# EasyEDA schematic PC Pump Controller_2021-02-13_17-24-19.json
TITLE: PC Fan to Pump Booster; REV: 2.0; Date: 2021-02-13; Sheet: 1/1; Drawn By: marshy459; Company: Dave Marsh
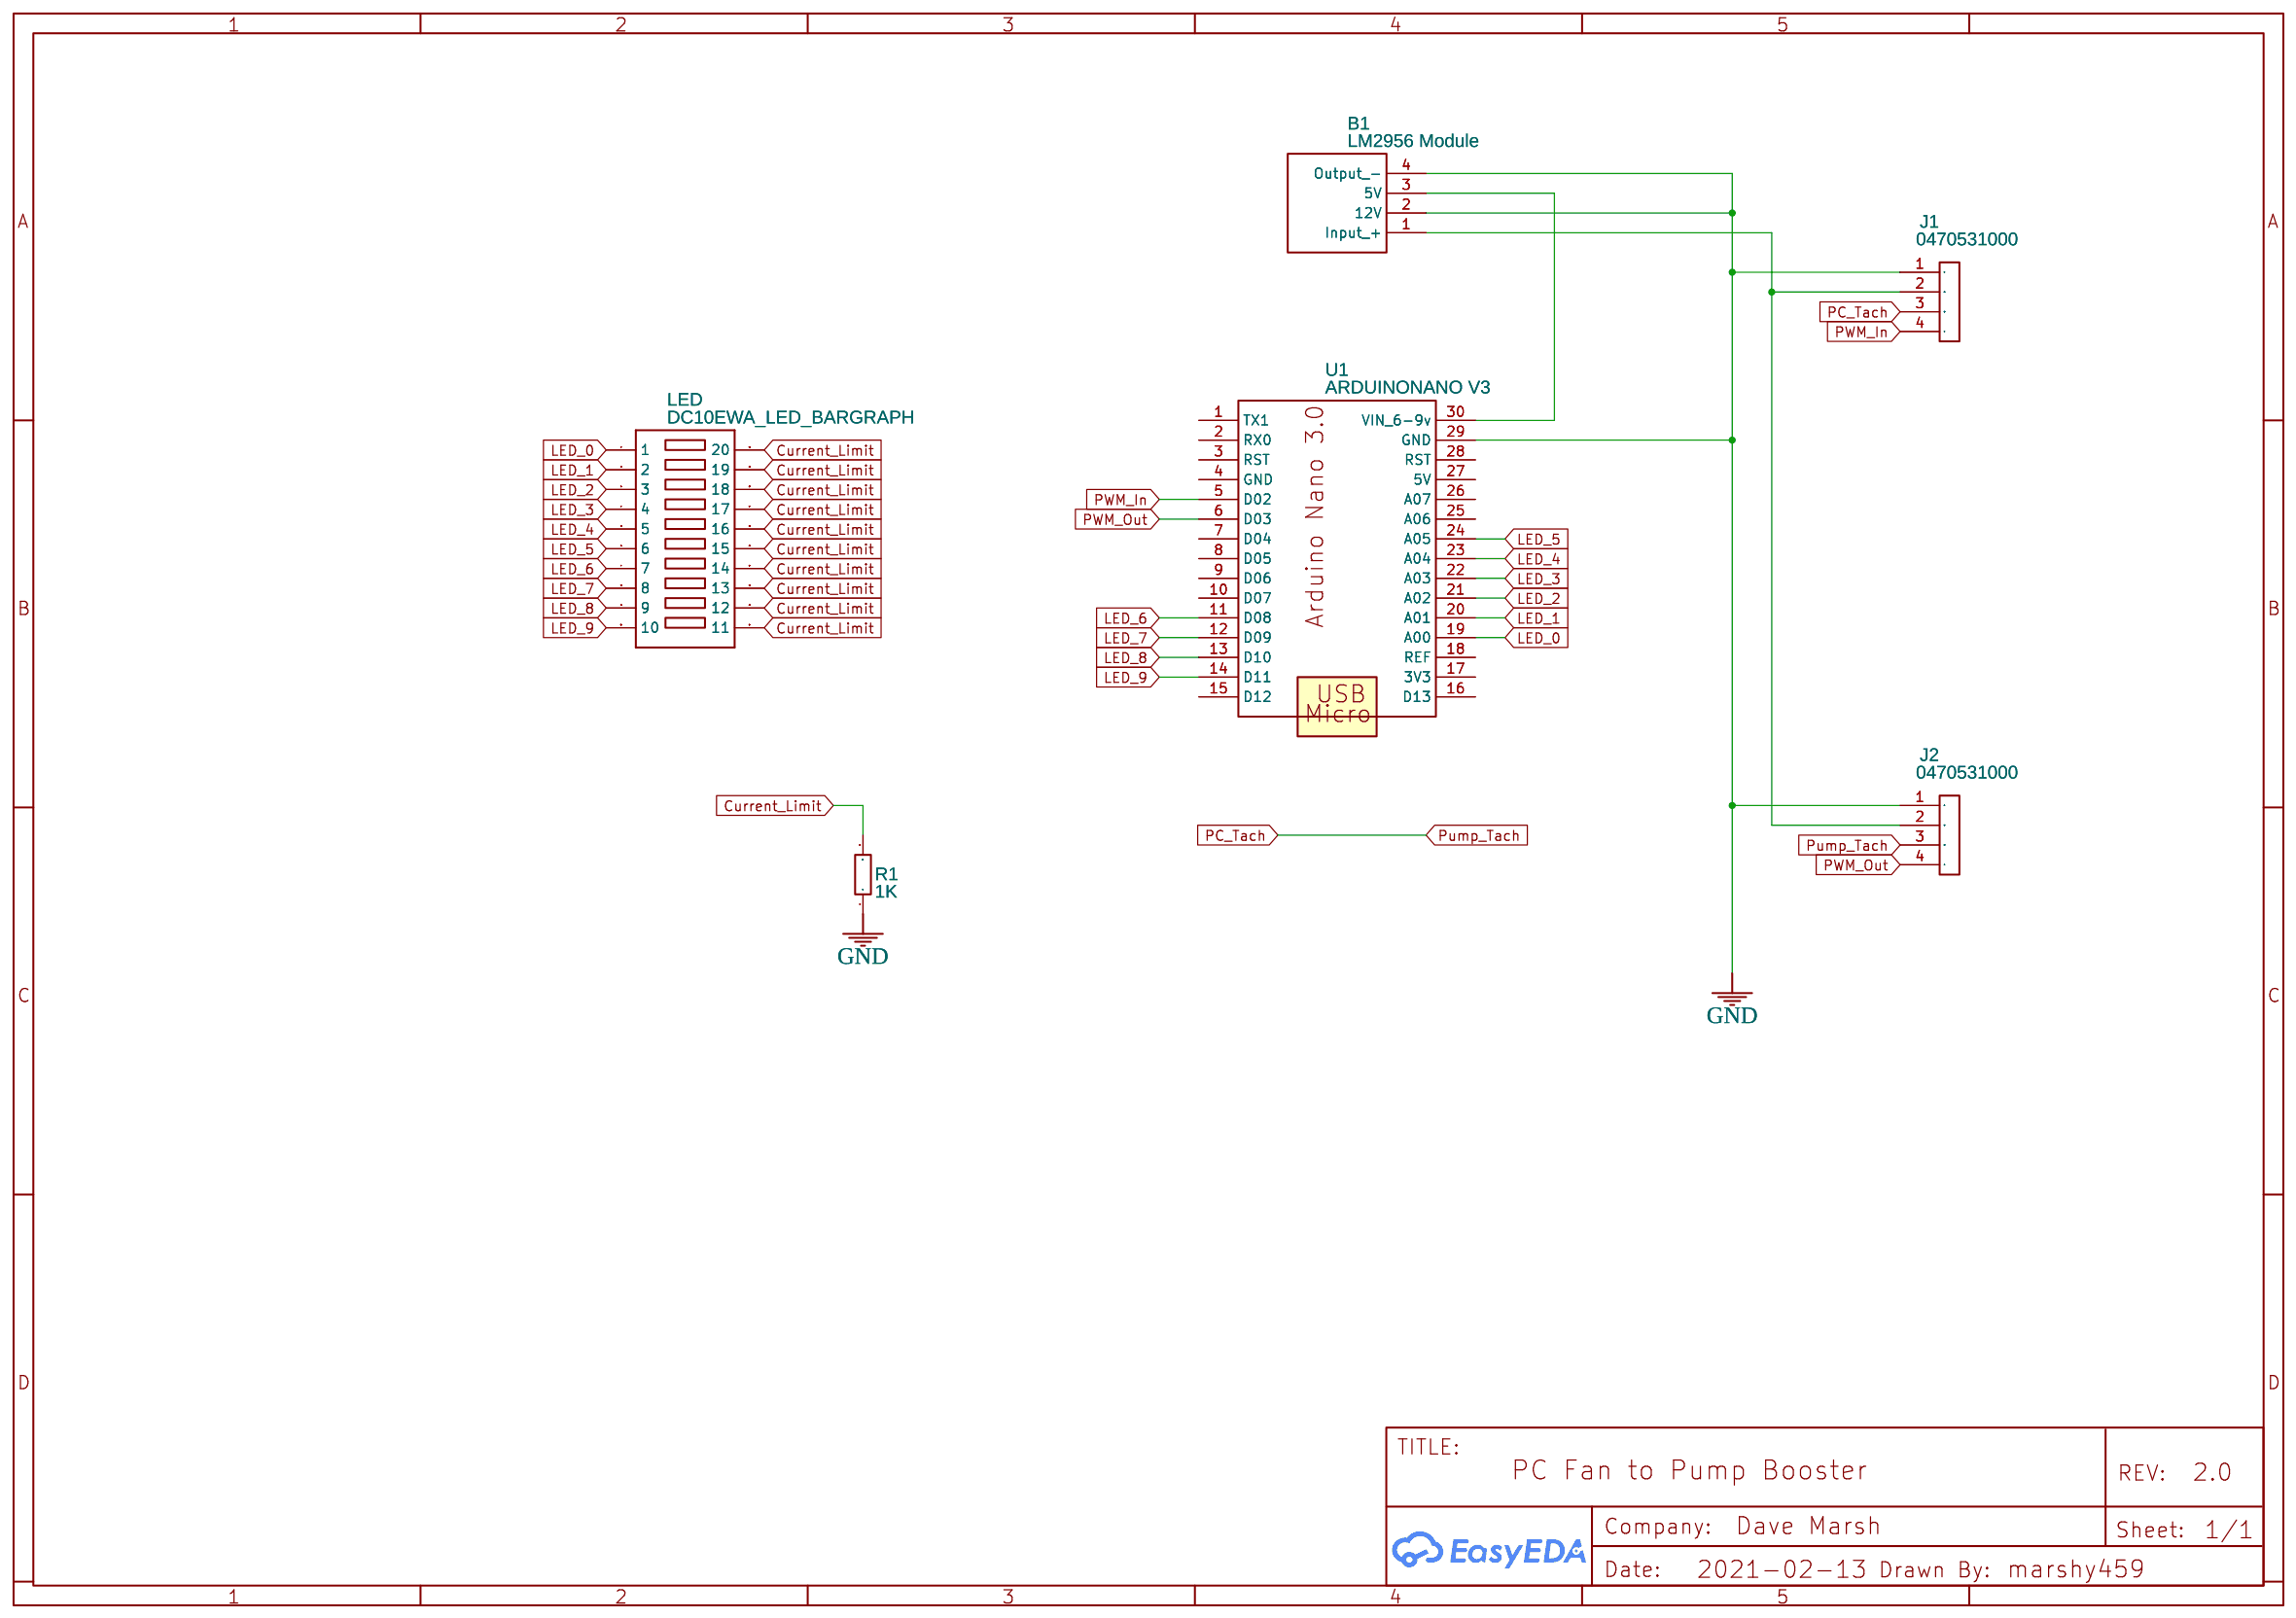
[diagram p0: schematic sheet]

## Parts
B1  LM2956 Module  [LM2596 MODULE]
J1  0470531000  [0470531000]
J2  0470531000  [0470531000]
LED  DC10EWA_LED_BARGRAPH  [DC10EWA_LED_BARGRAPH]
R1  1K  [R1206]
U1  ARDUINONANO V3  [ARDUINO NANO 3.0 NEW]

## Library data of the parts
B1 = LM2956 Module: Supplier: LCSC; Contributor: ahli.irfan.49
J1 J2 = 0470531000: Manufacturer: Molex, LLC; Supplier: Digi-Key; Supplier Part: WM4330-ND; link: https://www.molex.com/pdm_docs/sd/470531000_sd.pdf; Contributor: meggawatts
LED = DC10EWA_LED_BARGRAPH: Supplier: Digi-Key; Manufacturer: KingBright; Contributor: Busuwe
R1 = RESISTOR 1K5 1206 YAGEO: Supplier: Digi-Key; Supplier Part: 311-1.50KFRCT-ND; Manufacturer: YAGEO; Manufacturer Part: RC1206FR-071K5L; Contributor: Andrei GURSCHI; link: https://www.digikey.com/product-detail/en/yageo/RC1206FR-071K5L/311-1.50KFRCT-ND/731388
U1 = ARDUINONANO V3: Manufacturer Part: ArduinoNanov3; link: https://www.arduino.cc/en/uploads/Main/ArduinoNano30Schematic.pdf; Contributor: Lars M

## Nets
GND: B1.2(12V) B1.4(Output -) J1.1 J2.1 R1.1 U1.29(GND)
Current_Limit: LED.11 LED.12 LED.13 LED.14 LED.15 LED.16 LED.17 LED.18 LED.19 LED.20 R1.2
LED_0: LED.1 U1.19(A00)
LED_1: LED.2 U1.20(A01)
LED_2: LED.3 U1.21(A02)
LED_3: LED.4 U1.22(A03)
LED_4: LED.5 U1.23(A04)
LED_5: LED.6 U1.24(A05)
LED_6: LED.7 U1.11(D08)
LED_7: LED.8 U1.12(D09)
LED_8: LED.9 U1.13(D10)
LED_9: LED.10 U1.14(D11)
PC_Tach: J1.3 J2.3
PWM_In: J1.4 U1.5(D02)
PWM_Out: J2.4 U1.6(D03)
Net-(B1-1): B1.1(Input +) J1.2 J2.2
Net-(B1-3): B1.3(5V) U1.30(VIN 6-9v)

Not connected (* = marked no-connect by the designer): U1 1(TX1) 2(RX0) 3(RST) 4(GND) 7(D04) 8(D05) 9(D06) 10(D07) 15(D12) 16(D13) 17(3V3) 18(REF) 25(A06) 26(A07) 27(5V) 28(RST)
